# Altium schematic sheet Current_Sink.SchDoc
size A; SheetNumber: 4; SheetTotal: 4
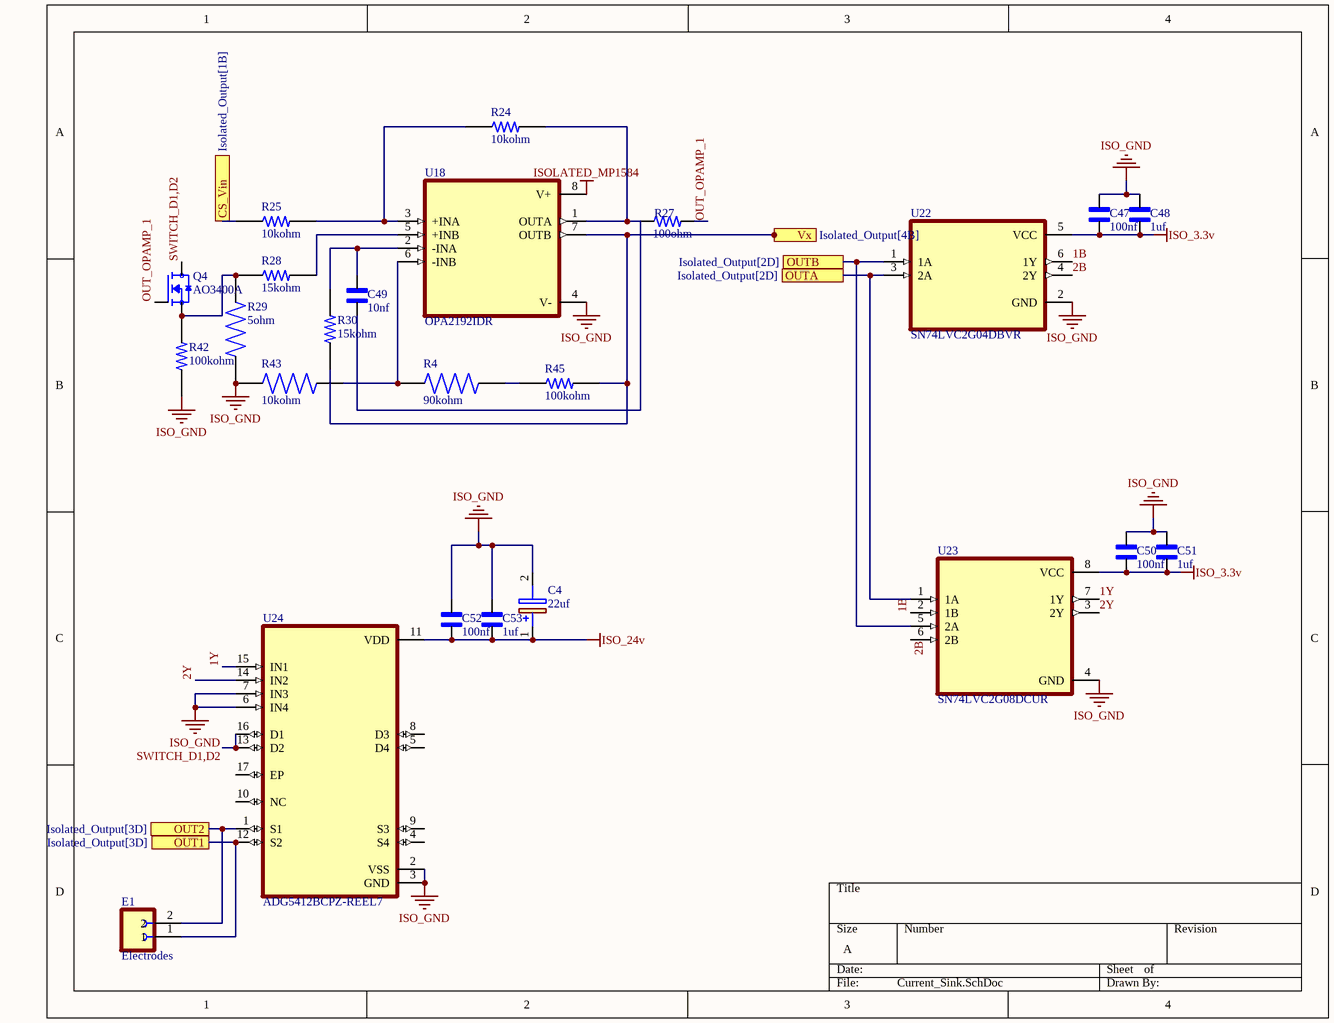
[diagram p0: Current_Sink.SchDoc]

## Parts
C4  22uf  [CAPAE660X610N]
C47  100nf  [CAPC1608X90]
C48  1uf  [CAPC1608X90]
C49  10nf  [CAPC1608X90]
C50  100nf  [CAPC1608X90]
C51  1uf  [CAPC1608X90]
C52  100nf  [CAPC1608X90]
C53  1uf  [CAPC1608X90]
E1  Electrodes  [JST_PHR-2]
Q4  AO3400A  [SOT95P280X125-3N]
R4  90kohm  [RESC2012X65N]
R24  10kohm  [RESC1607X60N]
R25  10kohm  [RESC1607X60N]
R27  100ohm  [RESC1607X60N]
R28  15kohm  [RESC1607X60N]
R29  5ohm  [RESC2012X50N]
R30  15kohm  [RESC1607X60N]
R42  100kohm  [RESC1607X60N]
R43  10kohm  [RESC2012X50N]
R45  100kohm  [RESC1607X60N]
U18  OPA2192IDR  [SOIC127P599X175-8N]
U22  SN74LVC2G04DBVR  [SOT95P280X145-6N]
U23  SN74LVC2G08DCUR  [SOP50P310X90-8N]
U24  ADG5412BCPZ-REEL7  [QFN65P400X400X80-17N]

## Ports
CS_Vin (see Isolated_Output[1B]), OUT1 (see Isolated_Output[3D]), OUT2 (see Isolated_Output[3D]), OUTA (see Isolated_Output[2D]), OUTB (see Isolated_Output[2D]), Vx (see Isolated_Output[4B])

## Nets
ISO_3.3v: C47.1 C48.1 C50.1 C51.1 U22.5(VCC) U23.8(VCC)
ISO_24v: C4.1(+) C52.1 C53.1 U24.11(VDD)
ISO_GND: C4.2(-) C47.2 C48.2 C50.2 C51.2 C52.2 C53.2 R29.1 R42.1 R43.1 U18.4(V-) U22.2(GND) U23.4(GND) U24.2(VSS) U24.3(GND) U24.6(IN4) U24.7(IN3)
ISOLATED_MP1584: U18.8(V+)
1B: U22.6(1Y) U23.2(1B)
1Y: U23.7(1Y) U24.15(IN1)
2B: U22.4(2Y) U23.6(2B)
2Y: U23.3(2Y) U24.14(IN2)
CS_Vin: R25.1 ; port CS_Vin
OUT1: E1.1 U24.12(S2) ; port OUT1
OUT2: E1.2 U24.1(S1) ; port OUT2
OUT_OPAMP_1: Q4.1(G) R27.2
OUTA: U22.3(2A) U23.1(1A) ; port OUTA
OUTB: U22.1(1A) U23.5(2A) ; port OUTB
SWITCH_D1,D2: Q4.3(D) U24.13(D2) U24.16(D1)
Vx: R30.1 R45.2 U18.7(OUTB) ; port Vx
NetC49_1: C49.1 R30.2 U18.2(-INA)
NetC49_2: C49.2 R24.2 R27.1 U18.1(OUTA)
NetQ4_2: Q4.2(S) R28.1 R29.2 R42.2
NetR4_1: R4.1 R43.2 U18.6(-INB)
NetR4_2: R4.2 R45.1
NetR24_1: R24.1 R25.2 U18.3(+INA)
NetR28_2: R28.2 U18.5(+INB)

Not connected (* = marked no-connect by the designer): U24 4(S4) 5(D4) 8(D3) 9(S3) 10(NC) 17(EP)

## Library data of the parts
C4 = HHXC500ARA220MF61G: Capacitor Polarised; Manufacturer_Name: Chemi-Con; Datasheet Link: https://www.chemi-con.co.jp/products/relatedfiles/capacitor/catalog/HXCRA-e.PDF; Height: 6.1mm; Manufacturer_Part_Number: HHXC500ARA220MF61G; Mouser Part Number: 661-HHXC500A220MF61G; Mouser Price/Stock: https://www.mouser.com/Search/Refine.aspx?Keyword=661-HHXC500A220MF61G; Arrow Part Number: HHXC500ARA220MF61G; Arrow Price/Stock: https://www.arrow.com/en/products/hhxc500ara220mf61g/united-chemi-con
C47-C53 = C0603KRX7R9BB102: 0603 1 nF 50 V Â±10 % Tolerance X7R Surface Mount Ceramic Capacitor; MF: Yageo; SnapEDA_Link: https://www.snapeda.com/parts/C0603KRX7R9BB102/Yageo/view-part/?ref=snap; Package: 0603 Yageo; Value: *; MP: C0603KRX7R9BB102; Check_prices: https://www.snapeda.com/parts/C0603KRX7R9BB102/Yageo/view-part/?ref=eda
E1 = PHR-2: PH Series 2 Position 2 mm Pitch Free Hanging Housing Connector; Value: *; MP: PHR-2; Package: None; Availability: Unavailable; Price: None
Q4 = AO3400A: N-Channel 30 V 5.7A (Ta) 1.4W (Ta) Surface Mount SOT-23-3; MF: Alpha & Omega Semiconductor; SnapEDA_Link: https://www.snapeda.com/parts/AO3400A/Alpha/view-part/?ref=snap; Package: SOT-23 Alpha &amp; Omega Semiconductor Inc.; Value: *; MP: AO3400A; Check_prices: https://www.snapeda.com/parts/AO3400A/Alpha/view-part/?ref=eda
R4 = RNCF0805BTE5R11: 5.11 Ohms Â±0.1% 0.25W, 1/4W Chip Resistor 0805 (2012 Metric) Automotive AEC-Q200 Thin Film; MF: Stackpole Electronics Inc; SnapEDA_Link: https://www.snapeda.com/parts/RNCF0805BTE5R11/Stackpole+Electronics/view-part/?ref=snap; Package: 2012 Stackpole; Value: *; MP: RNCF0805BTE5R11; Check_prices: https://www.snapeda.com/parts/RNCF0805BTE5R11/Stackpole+Electronics/view-part/?ref=eda
R24 R25 R27 R28 R30 R42 R45 = RC0603JR-0710KL: 10 kOhms Â±5% 0.1W, 1/10W Chip Resistor 0603 (1608 Metric) Moisture Resistant Thick Film; MF: Yageo; SnapEDA_Link: https://www.snapeda.com/parts/RC0603JR-0710KL/Yageo/view-part/?ref=snap; Package: 0603 Yageo; Value: *; MP: RC0603JR-0710KL; Check_prices: https://www.snapeda.com/parts/RC0603JR-0710KL/Yageo/view-part/?ref=eda
R29 R43 = RG2012V-103-P-T1: 10 kOhms Â±0.02% 0.125W, 1/8W Chip Resistor 0805 (2012 Metric) Anti-Sulfur, Automotive AEC-Q200 Thin Film; MF: Susumu; SnapEDA_Link: https://www.snapeda.com/parts/RG2012V-103-P-T1/Susumu/view-part/?ref=snap; Package: 2012 TE Connectivity; Value: *; MP: RG2012V-103-P-T1; Check_prices: https://www.snapeda.com/parts/RG2012V-103-P-T1/Susumu/view-part/?ref=eda
U18 = OPA2192IDR: 36-V, Precision, RRIO, Low Offset Voltage, Low Input Bias Current Op Amp With e-trim; MF: Texas Instruments; SnapEDA_Link: https://www.snapeda.com/parts/OPA2192IDR/Texas+Instruments/view-part/?ref=snap; Package: SOIC-8 Texas Instruments; Value: *; MP: OPA2192IDR; Check_prices: https://www.snapeda.com/parts/OPA2192IDR/Texas+Instruments/view-part/?ref=eda
U22 = SN74LVC2G04DBVR: 2-ch, 1.65-V to 5.5-V inverters; MF: Texas Instruments; SnapEDA_Link: https://www.snapeda.com/parts/SN74LVC2G04DBVR/Texas+Instruments/view-part/?ref=snap; Package: SOT-23-6 Texas Instruments; Value: *; MP: SN74LVC2G04DBVR; Check_prices: https://www.snapeda.com/parts/SN74LVC2G04DBVR/Texas+Instruments/view-part/?ref=eda
U23 = SN74LVC2G08DCUR: 2-ch, 2-input, 1.65-V to 5.5-V AND gates; MF: Texas Instruments; Price: None; Availability: In Stock; MP: SN74LVC2G08DCUR; Package: VSSOP-8 Texas Instruments; SnapEDA_Link: https://www.snapeda.com/parts/SN74LVC2G08DCUR/Texas+Instruments/view-part/?ref=snap; Check_prices: https://www.snapeda.com/parts/SN74LVC2G08DCUR/Texas+Instruments/view-part/?ref=eda; Value: *; Purchase-URL: https://pricing.snapeda.com/search/part/SN74LVC2G08DCUR/?ref=eda
U24 = ADG5412BCPZ-REEL7: High Voltage Latch-Up Proof, Quad SPST Switches; MF: Analog Devices; SnapEDA_Link: https://www.snapeda.com/parts/ADG5412BCPZ-REEL7/Analog+Devices/view-part/?ref=snap; Package: LFCSP -16 Analog Devices; Value: *; MP: ADG5412BCPZ-REEL7; Check_prices: https://www.snapeda.com/parts/ADG5412BCPZ-REEL7/Analog+Devices/view-part/?ref=eda